# EAGLE design pcb_univ_3-101-0-x-rev2 (EAGLE 7.7.0)
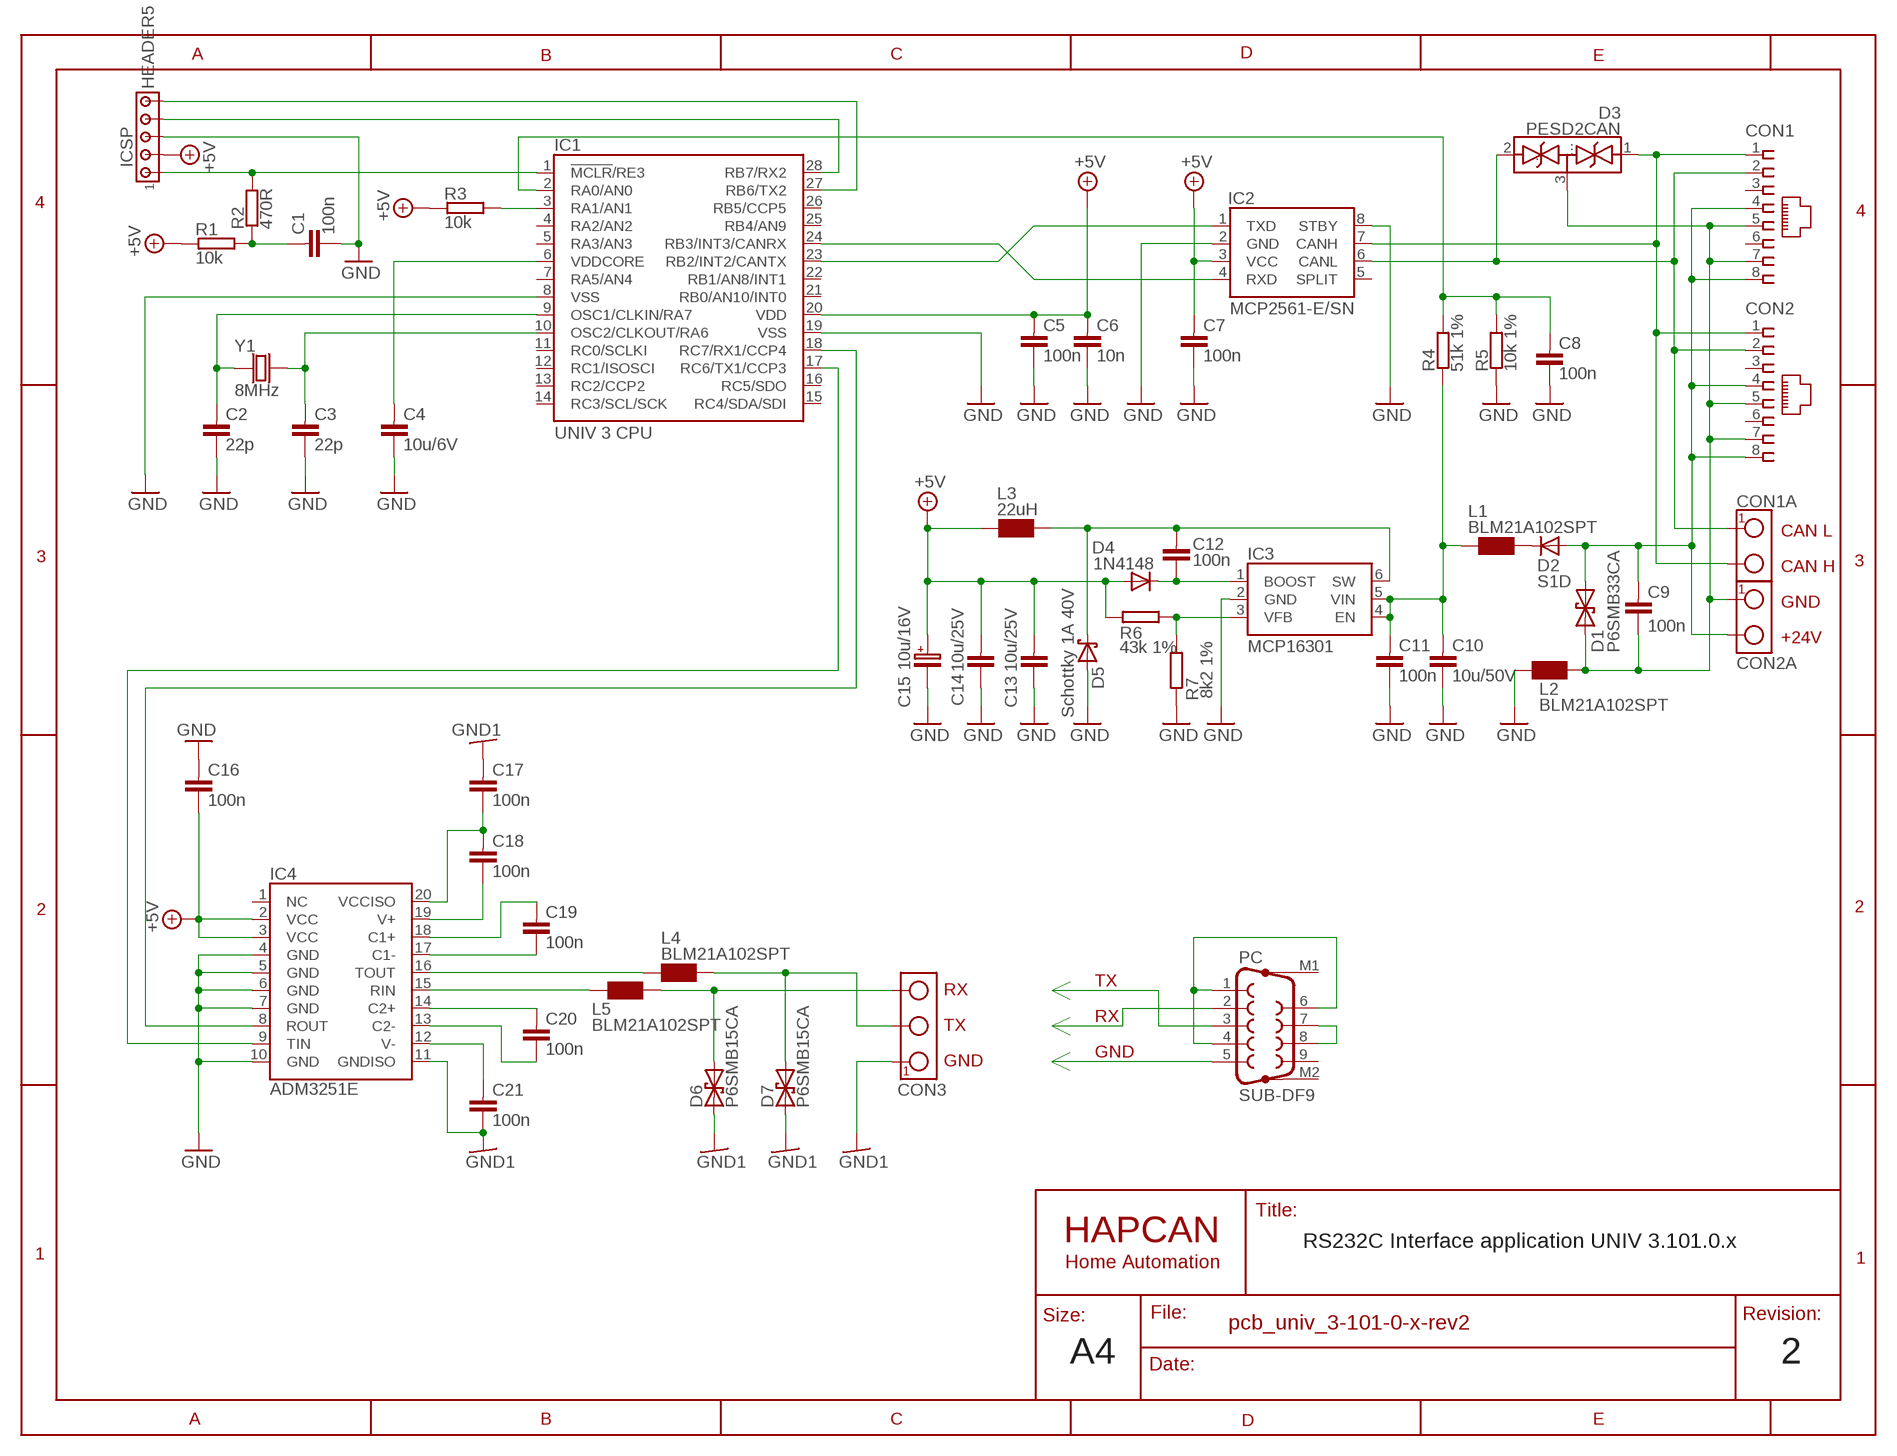
[diagram p0: schematic, sheet 1]

## Parts
C1  100n  CAPACITOR0805  [0805]
C2  22p  CAPACITOR0805  [0805]
C3  22p  CAPACITOR0805  [0805]
C4  10u/6V  CAPACITOR0805  [0805]
C5  100n  CAPACITOR0805  [0805]
C6  10n  CAPACITOR0805  [0805]
C7  100n  CAPACITOR0805  [0805]
C8  100n  CAPACITOR0805  [0805]
C9  100n  CAPACITOR0805  [0805]
C10  10u/50V  CAPACITOR1210  [1210]
C11  100n  CAPACITOR0805  [0805]
C12  100n  CAPACITOR0805  [0805]
C13  10u/25V  CAPACITOR1206  [1206]
C14  10u/25V  CAPACITOR1206  [1206]
C15  10u/16V  CAPACITOR-POLARIZED-SMC_B  [SMC_B]
C16  100n  CAPACITOR0805  [0805]
C17  100n  CAPACITOR0805  [0805]
C18  100n  CAPACITOR0805  [0805]
C19  100n  CAPACITOR0805  [0805]
C20  100n  CAPACITOR0805  [0805]
C21  100n  CAPACITOR0805  [0805]
CON1  RJ45-SOCKET  [RJ45-PCB-SOCKET]
CON1A  TERMINAL-2  TERMINAL-2-5X10,5MM  [ARK2-5X10,5MM]
CON2  RJ45-SOCKET  [RJ45-PCB-SOCKET]
CON2A  TERMINAL-2  TERMINAL-2-5X10,5MM  [ARK2-5X10,5MM]
CON3  TERMINAL-3-5X10.5MM  [ARK3-5X10.5MM]
D1  P6SMB33CA  DIODE_TRANSIL2  [DO-214_TRANSIL2]
D2  S1D  DIODE_DO-214  [DO-214]
D3  PESD2CAN  PESD2CANSOT-23  [SOT-23]
D4  1N4148  DIODE_0805  [0805]
D5  Schottky 1A 40V  DIODE_TRANSIL1_DO214  [DO-214]
D6  P6SMB15CA  DIODE_TRANSIL2  [DO-214_TRANSIL2]
D7  P6SMB15CA  DIODE_TRANSIL2  [DO-214_TRANSIL2]
IC1  UNIV 3 CPU  UNIV3CPU-I/SO  [UNIV3CPU]
IC2  MCP2561-E/SN  [SO-08]
IC3  MCP16301  MCP16301SOT23-6  [SOT-23-6]
IC4  ADM3251E  [SO-20W]
ICSP  HEADER5  [SIP-5]
L1  BLM21A102SPT  CHOKE0805  [0805]
L2  BLM21A102SPT  CHOKE0805  [0805]
L3  22uH  CHOKEDER0705  [CHOKE-DER0705]
L4  BLM21A102SPT  CHOKE0805  [0805]
L5  BLM21A102SPT  CHOKE0805  [0805]
PC  SUB-DF9  [SUB-D9FH-7.2MM]
R1  10k  RESISTOR0805  [0805]
R2  470R  RESISTOR0805  [0805]
R3  10k  RESISTOR0805  [0805]
R4  51k 1%  RESISTOR0805  [0805]
R5  10k 1%  RESISTOR0805  [0805]
R6  43k 1%  RESISTOR0805  [0805]
R7  8k2 1%  RESISTOR0805  [0805]
Y1  8MHz  CRYSTAL-HC49V  [CRYSTAL-HC49V]

## Nets
+5V: C5.1 C6.1 C7.1 C13.1 C14.1 C15.+ C16.2 D4.2(A) IC1.20(VDD) IC2.3(VCC) IC4.2(VCC) IC4.3(VCC) ICSP.2 L3.1 R1.1 R3.1 R6.1
GND: C1.2 C2.2 C3.2 C4.2 C5.2 C6.2 C7.2 C8.2 C10.2 C11.2 C13.2 C14.2 C15.- C16.1 D5.A IC1.8(VSS) IC1.19(VSS) IC2.2(GND) IC2.8(STBY) IC3.2(GND) IC4.4(GND) IC4.5(GND) IC4.6(GND) IC4.7(GND) IC4.10(GND) ICSP.3 L2.1 R5.1 R7.1
GNDIO: C17.1 C21.2 CON3.1 D6.C D7.C IC4.11(GNDISO) ; supply symbol labelled GND1
ICSP: IC1.1(!MCLR!/RE3) ICSP.1 R2.2
N$1: C20.2 IC4.13(C2-)
N$2: IC1.24(RB3/INT3/CANRX) IC2.4(RXD)
N$3: IC1.23(RB2/INT2/CANTX) IC2.1(TXD)
N$4: CON3.2 D7.A L4.1
N$5: C12.1 D5.C IC3.6(SW) L3.2
N$6: IC3.3(VFB) R6.2 R7.2
N$7: C1.1 R1.2 R2.1
N$8: C8.1 IC1.2(RA0/AN0) R4.2 R5.2
N$9: CON1.1 CON1A.2 CON2.1 D3.1(.) IC2.7(CANH)
N$10: IC1.28(RB7/RX2) ICSP.4
N$11: C2.1 IC1.9(OSC1/CLKIN/RA7) Y1.1
N$12: IC1.3(RA1/AN1) R3.2
N$13: CON1.2 CON1A.1 CON2.2 D3.2(..) IC2.6(CANL)
N$14: IC1.27(RB6/TX2) ICSP.5
N$15: C3.1 IC1.10(OSC2/CLKOUT/RA6) Y1.2
N$16: C10.1 C11.1 IC3.4(EN) IC3.5(VIN) L1.1 R4.1
N$17: PC.2
N$18: C9.2 CON1.5 CON1.7 CON2.5 CON2.7 CON2A.1 D1.C D3.3(...) L2.2
N$19: CON3.3 D6.A L5.1
N$20: PC.3
N$22: IC4.16(TOUT) L4.2
N$23: PC.7 PC.8
N$24: IC4.15(RIN) L5.2
N$25: C19.2 IC4.17(C1-)
N$26: C20.1 IC4.14(C2+)
N$27: C19.1 IC4.18(C1+)
N$28: PC.5
N$29: IC1.17(RC6/TX1/CCP3) IC4.9(TIN)
N$31: C18.2 IC4.19(V+)
N$33: IC1.18(RC7/RX1/CCP4) IC4.8(ROUT)
N$34: C17.2 C18.1 IC4.20(VCCISO)
N$35: C21.1 IC4.12(V-)
N$38: C12.2 D4.1(C) IC3.1(BOOST)
N$56: C4.1 IC1.6(VDDCORE)
N$59: C9.1 CON1.4 CON1.8 CON2.4 CON2.8 CON2A.2 D1.A D2.A
N$61: D2.C L1.2
PC: PC.1 PC.4 PC.6
Unconnected: CON1.3 CON1.6 CON2.3 CON2.6 IC1.4(RA2/AN2) IC1.5(RA3/AN3) IC1.7(RA5/AN4) IC1.11(RC0/SCLKI) IC1.12(RC1/ISOSCI) IC1.13(RC2/CCP2) IC1.14(RC3/SCL/SCK) IC1.15(RC4/SDA/SDI) IC1.16(RC5/SDO) IC1.21(RB0/AN10/INT0) IC1.22(RB1/AN8/INT1) IC1.25(RB4/AN9) IC1.26(RB5/CCP5) IC2.5(SPLIT) IC4.1(NC) PC.9 PC.M1(G1) PC.M2(G2)

## Notes on the sheet
- CAN L
- CAN H
- GND
- +24V
- TX
- RX
- RX
- TX
- GND
- GND
- RS232C Interface application UNIV 3.101.0.x
- A4 | 2

## Library data of the parts
C1-C14 C16-C21 = HAPCAN_devices - UNIV3:CAPACITOR: HAPCAN Capacitor
C15 = HAPCAN_devices - UNIV3:CAPACITOR-POLARIZED: HAPCAN Polarazied Capacitor
CON1 CON2 = HAPCAN_devices - UNIV3:RJ45-SOCKET: HAPCAN RJ45 socket
CON1A CON2A = HAPCAN_devices - UNIV3:TERMINAL-2: HAPCAN Terminal Block - 2 way
CON3 = HAPCAN_devices - UNIV3:TERMINAL-3: HAPCAN Terminal Block - 3 way
D1 D6 D7 = HAPCAN_devices - UNIV3:DIODE_TRANSIL2: HAPCAN Bidirectional transil diode
D2 D4 = HAPCAN_devices - UNIV3:DIODE: HAPCAN Rectifier Diode
D3 = HAPCAN_devices - UNIV3:PESD2CAN: CAN bus ESD protection diode
D5 = HAPCAN_devices - UNIV3:DIODE_TRANSIL1: HAPCAN Unidirectional transil diode
IC1 = HAPCAN_devices - UNIV3:UNIV3CPU: HAPCAN Microcontroller UNIV 3 CPU
IC2 = HAPCAN_devices - UNIV3:MCP2561: HAPCAN CAN Tranceiver
IC3 = HAPCAN_devices - UNIV3:MCP16301: High Voltage Input Integrated Switch Step-Down Regulator
IC4 = HAPCAN_devices - UNIV3:ADM3251E: RS232C isolated transceiver
ICSP = HAPCAN_devices - UNIV3:HEADER5: HAPCAN Header 5
L1-L5 = HAPCAN_devices - UNIV3:CHOKE: Choke
PC = HAPCAN_devices - UNIV3:SUB-DF9: HAPCAN SUB-D 9 pin female connector
R1-R7 = HAPCAN_devices - UNIV3:RESISTOR: HAPCAN Resistor
Y1 = HAPCAN_devices - UNIV3:CRYSTAL: HAPCAN Crystal

## Board
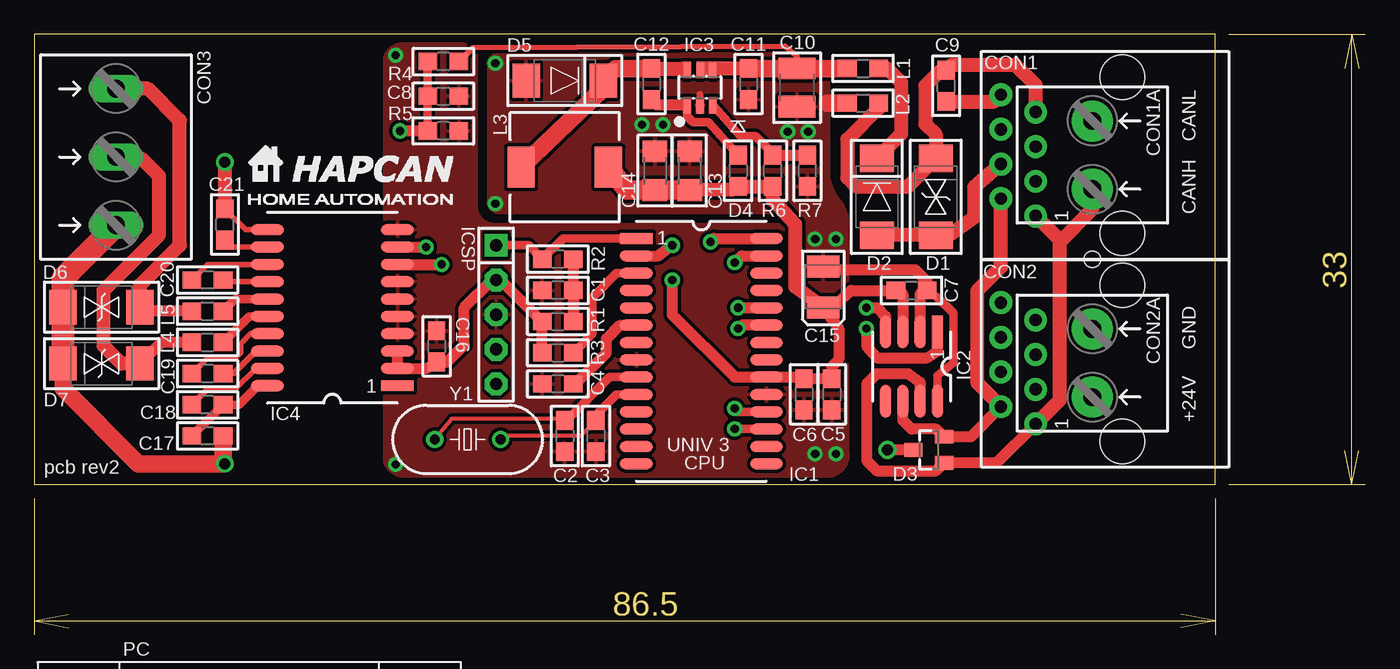
[diagram p1: board, top side]
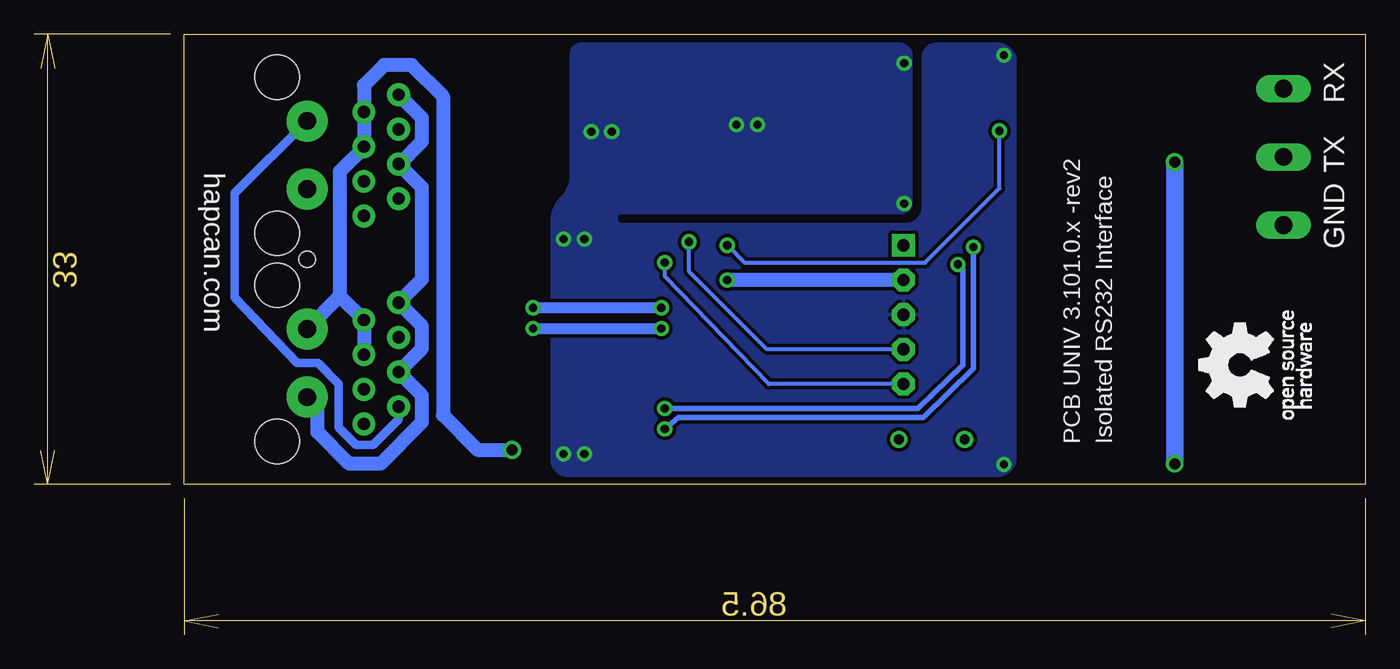
[diagram p2: board, bottom side, seen from below]

Size 97.5 x 44 mm. Coordinates in mm from the lower left corner, seen from the top.
Outline: 0,10 0,1
Outline: 0,1 0,0
Outline: 86.5,10 86.5,1
Outline: 86.5,1 86.5,0
Outline: 0,1 86.5,1
Outline: 86.5,1 84,1.5
Outline: 86.5,1 84,0.5
Outline: 0,1 2.5,1.5
Outline: 0,1 2.5,0.5
Outline: 87.5,11 96.5,11
Outline: 96.5,11 97.5,11
Outline: 87.5,44 96.5,44
Outline: 96.5,44 97.5,44
Outline: 96.5,11 96.5,44
Outline: 96.5,44 96,41.5
Outline: 96.5,44 97,41.5
Outline: 96.5,11 96,13.5
Outline: 96.5,11 97,13.5
Outline: 86.5,11 86.5,44 0,44 0,11 86.5,11
Copper layers (1*16): Top 0.035mm / dielectric 1.5mm / Bottom 0.035mm
Design rules "HAPCAN-Drc *": minimum track width 10mil, minimum drill 0.5mm, track to track 10mil, track to pad 10mil, pad to pad 12mil, via to via 12mil, smd to smd 0mil, copper to edge 20mil, drill to drill 8mil, minimum pad ring 10mil, minimum via ring 10mil, stop-mask expansion 4mil, vias tented up to drill 0mil, thermal gap 10mil
Holes 1.2 mm at 77.5,27.5

### Footprints (pad centres in the part's own frame; a part is rotated, then mirrored left to right if it is on the bottom)
0805 = smd 1.372 x 1.27: 1 -1.143,0; 2 1.143,0
1210 = smd 1.6 x 2.7: 1 -1.4,0; 2 1.4,0
1206 = smd 1.6 x 1.803: 1 -1.422,0; 2 1.422,0
SMC_B = smd 1.6 x 2.4: + -1.5,0; - 1.5,0
RJ45-PCB-SOCKET = drill 0.9 pad 1.676: 1 -4.445,6.35; 2 -3.175,8.89; 3 -1.905,6.35; 4 -0.635,8.89; 5 0.635,6.35; 6 1.905,8.89; 7 3.175,6.35; 8 4.445,8.89 | hole 3.251: -5.715,0; 5.715,0
ARK2-5X10,5MM = drill 1.3 pad 3: 1 -2.5,0; 2 2.5,0
ARK3-5X10.5MM = drill 1.3 pad 2 long: 1 -5,0; 2 0,0; 3 5,0
DO-214_TRANSIL2 = smd 2 x 2.5: A 2.82,0; C -2.82,0
DO-214 = smd 2 x 2.5: A 2.82,0; C -2.82,0
SOT-23 = smd 1.016 x 1.321: 1 -0.965,-1.118; 2 0.965,-1.118; 3 0,1.118
UNIV3CPU = smd 2.4 x 0.8: 1 -4.763,8.255; 2 -4.763,6.985; 3 -4.763,5.715; 4 -4.763,4.445; 5 -4.763,3.175; 6 -4.763,1.905; 7 -4.763,0.635; 8 -4.763,-0.635; 9 -4.763,-1.905; 10 -4.763,-3.175; 11 -4.763,-4.445; 12 -4.763,-5.715; 13 -4.763,-6.985; 14 -4.763,-8.255; 15 4.763,-8.255; 16 4.763,-6.985; 17 4.763,-5.715; 18 4.763,-4.445; 19 4.763,-3.175; 20 4.763,-1.905; 21 4.763,-0.635; 22 4.763,0.635; 23 4.763,1.905; 24 4.763,3.175; 25 4.763,4.445; 26 4.763,5.715; 27 4.763,6.985; 28 4.763,8.255
SO-08 = smd 2.4 x 0.8: 1 -2.54,1.905; 2 -2.54,0.635; 3 -2.54,-0.635; 4 -2.54,-1.905; 5 2.54,-1.905; 6 2.54,-0.635; 7 2.54,0.635; 8 2.54,1.905
SOT-23-6 = smd 0.55 x 1.2: 1 -0.95,-1.3; 2 0,-1.3; 3 0.95,-1.3; 4 0.95,1.3; 5 0.003,1.3; 6 -0.95,1.3
SO-20W = smd 2.4 x 0.8: 1 -4.763,5.715; 2 -4.763,4.445; 3 -4.763,3.175; 4 -4.763,1.905; 5 -4.763,0.635; 6 -4.763,-0.635; 7 -4.763,-1.905; 8 -4.763,-3.175; 9 -4.763,-4.445; 10 -4.763,-5.715; 11 4.763,-5.715; 12 4.763,-4.445; 13 4.763,-3.175; 14 4.763,-1.905; 15 4.763,-0.635; 16 4.763,0.635; 17 4.763,1.905; 18 4.763,3.175; 19 4.763,4.445; 20 4.763,5.715
SIP-5 = drill 0.9 pad 1.676 square: 1 -5.08,0 | drill 0.9 pad 1.676 octagon: 2 -2.54,0; 3 0,0; 4 2.54,0; 5 5.08,0
CHOKE-DER0705 = smd 2 x 3: 1 -3.2,0; 2 3.2,0
SUB-D9FH-7.2MM = drill 1.194 pad 1.676 square: 1 5.537,2.033 | drill 1.194 pad 1.676 octagon: 2 2.769,2.033; 3 0,2.033; 4 -2.769,2.033; 5 -5.537,2.033; 6 4.153,-0.81; 7 1.384,-0.81; 8 -1.384,-0.81; 9 -4.153,-0.81 | drill 3.048: M1 -12.446,0.635; M2 12.446,0.635
CRYSTAL-HC49V = drill 0.7 pad 1.27: 1 -2.413,0; 2 2.413,0

### Placement (x,y rotation side)
C1  38.35,25.22 180 top
C2  38.86,14.56 270 top
C3  41.15,14.56 270 top
C4  38.35,18.37 180 top
C5  56.39,17.6 270 top
C6  58.42,17.6 270 top
C7  64.26,25.22 0 top
C8  29.97,39.45 0 top
C9  66.8,40.21 90 top
C10  55.88,40.08 270 top
C11  52.32,40.34 270 top
C12  45.21,40.34 270 top
C13  48.01,33.99 90 top
C14  45.47,33.99 90 top
C15  57.78,25.48 90 top
C16  29.48,21.12 270 top
C17  12.7,14.56 180 top
C18  12.7,16.84 180 top
C19  12.7,19.13 180 top
C20  12.7,25.99 180 top
C21  13.97,30.05 90 top
CON1  79.7,35.12 90 top
CON1A  77.5,35.14 270 top
CON2  79.7,19.88 90 top
CON2A  77.5,19.9 270 top
CON3  6,35 90 top
D1  66.04,32.08 270 top
D2  61.72,32.08 270 top
D3  65.53,13.54 90 top
D4  51.56,33.99 270 top
D5  38.86,40.59 180 top
D6  4.94,23.99 0 top
D7  4.94,19.86 0 top
IC1  48.87,20.77 0 top
IC2  64.26,19.64 270 top
IC3  48.77,40.08 0 top
IC4  21.84,23.95 180 top
ICSP  33.83,23.45 270 top
L1  60.71,41.48 0 top
L2  60.71,38.94 0 top
L3  38.86,34.24 180 top
L4  12.7,21.41 0 top
L5  12.7,23.7 0 top
PC  15.75,-6.02 0 top  (outside the outline)
R1  38.35,22.94 0 top
R2  38.35,27.51 180 top
R3  38.35,20.65 0 top
R4  29.97,41.99 180 top
R5  29.97,36.91 180 top
R6  54.1,33.99 90 top
R7  56.64,33.99 90 top
Y1  31.75,14.3 0 top

### Tracks (layer width: path | path; a pad name or v marks a point on that pad's centre or on a via)
+5V  (via drill 0.6 pad 1.02)
  Top 0.406: IC2.3 63.63,22.43
  Top 0.813: v46.74,25.99 46.73,25.72 46.73,23.45 51.32,18.87 IC1.20 56.02,18.87 C5.1 C6.1 58.42,19.64 58.93,20.14 58.93,22.43 C15.+ 58.42,23.95 59.84,25.22 C7.1 63.63,24.97 63.62,24.97 IC2.3 | IC4.3 IC4.2 28.75,19.51 C16.2 30.24,19.98 31.5,21.23 31.5,23.95 33.53,25.99 ICSP.2 34.16,25.99 R1.1 | R3.1 R1.1 | R1.1 37.34,22.94
  Top 1.016: C13.1 51.08,32.59 D4.2 R6.1 54.1,31.83 55.75,30.05 55.75,25.48 57.76,23.98 C15.+
  Top 1.422: C13.1 C14.1 43.43,32.56 L3.1
  Bottom 1.016: ICSP.2 v46.74,25.99
GND  (via drill 0.6 pad 1.02)
  Top 0.406: IC2.2 64.9,22.43 | IC2.8 66.16,17.35
  Top 0.508: 48.77,39.58 IC3.2
  Top 0.61: IC2.8 66.16,19 67.31,19.89 67.31,23.57 66.17,24.72 C7.2
  Top 0.813: IC2.2 64.89,24.96 C7.2 65.41,25.86 64.52,26.75 58.14,26.75 C15.-
  Top 1.016: D5.A 35.53,41.1
  Top 1.27: L2.1 58.12,38.94
  other vias: 55.19,36.86 33.78,41.86 46.05,37.37 44.53,37.37 56.69,36.86 33.78,31.57 58.72,28.98 57.2,28.98 58.72,13.24 57.2,13.24 26.47,42.45 26.47,12.47
  pour Top: 34.29,42.62 58.17,42.62 58.17,31.7 57.91,30.94 34.04,30.94 arc-90 33.27,31.7 33.27,41.86 arc-90
  pour Top: 26.92,43.26 arc90 25.65,41.99 25.65,12.9 arc90 27.18,11.63 58.42,11.63 arc90 59.56,13.54 59.56,28.02 arc90 58.42,30.05 33.78,30.05 arc-90 32.38,31.32 32.38,41.99 arc90 31.5,43.26
  pour Top: 55.88,31.07 56.64,30.3 56.64,29.29 56.9,29.03 59.56,29.03 59.56,30.3 arc30 59.05,31.7 arc-30 58.17,33.61
  pour Bottom: 33.27,42.5 33.27,31.7 arc97 34.16,30.94 54.48,30.94 arc-90 54.86,30.56 54.86,30.43 arc-90 54.48,30.05 33.78,30.05 arc-90 32.38,31.32 32.38,42.37 arc90 31.37,43.26 26.92,43.26 arc90 25.65,41.99 25.65,13.03 arc95 27.18,11.63 58.29,11.63 arc90 59.56,12.78 59.56,29.92 arc46 58.93,31.95 arc-48 58.17,33.61 58.17,42.5 arc90 57.4,43.26 34.16,43.26 arc90
GNDIO  (via drill 0.8)
  Top 0.406: IC4.11 15.49,29.67 C21.2
  Top 1.016: v13.97,34.62 C21.2
  Top 1.27: D7.C 2.12,18.02 7.62,12.52 v13.97,12.52 13.84,12.65 C17.1
  Top 1.676: D7.C D6.C 2.12,26.12 CON3.1
  Bottom 1.27: v13.97,12.52 v13.97,34.62
ICSP
  Top 0.61: IC1.1 38.73,29.02 R2.2 36.2,28.53 ICSP.1
N$1
  Top 0.406: C20.2 12.7,27.13 IC4.13
N$2  (via drill 0.6 pad 1.02)
  Top 0.406: IC2.4 62.35,22.43
  Top 0.813: v60.96,23.95 61.72,23.95 62.36,23.32 62.35,23.32 IC2.4 | IC1.24 51.83,23.95 v51.56,23.95
  Bottom 0.813: v60.96,23.95 v51.56,23.95
N$3  (via drill 0.6 pad 1.02)
  Top 0.813: v60.96,22.43 60.96,21.16 61.72,20.27 65.41,20.27 66.17,20.78 66.17,22.43 IC2.1 | IC1.23 51.81,22.68 v51.56,22.43
  Bottom 0.813: v60.96,22.43 v51.56,22.43
N$4
  Top 0.813: L4.1 9.31,21.41 D7.A
  Top 1.016: D7.A 6.38,19.86 5.08,21.16 5.08,25.22 9.14,29.29 9.14,33.61 7.87,34.88 6.12,34.88 CON3.2
N$5
  Top 0.254: 47.57,41.48 47.72,41.48 IC3.6
  Top 1.016: D5.C 42.57,41.48 | C12.1 47.57,41.48
  Top 1.27: 42.57,41.48 C12.1 | L3.2 41.68,40.01 D5.C
N$6
  Top 0.61: R6.2 53.98,35.38 52.83,36.53 51.72,36.53 IC3.3
  Top 0.813: R6.2 R7.2
N$7
  Top 0.813: R2.1 R1.2 C1.1
N$8  (via drill 0.6)
  Top 0.61: R4.2 C8.1 R5.2
  Top 0.813: IC1.2 45.71,27.75 v46.74,28.53 | R5.2 v26.8,36.91
  Bottom 0.305: v46.74,28.53 45.47,27.26 32.26,27.26 26.8,32.72 v26.8,36.91
N$9
  Top 0.406: IC2.7 64.89,17.35
  Top 0.813: CON2.1 70.49,12.57 D3.1 66.06,12.02 61.72,12.02 60.96,12.78 60.96,18.37 61.72,19.13 64.01,19.13 64.9,18.49 64.89,18.24 IC2.7
  Top 1.016: CON2.1 75.11,17.19 75.11,28.78 | 75.11,28.78 75.11,28.92 CON1.1 | CON1A.2 77.5,31.17 75.11,28.78
N$10  (via drill 0.6 pad 1.02)
  Top 0.813: IC1.28 49.77,29.02 v49.53,28.78
  Bottom 0.305: ICSP.4 43.81,20.91 49.53,26.62 v49.53,28.78
N$11
  Top 0.305: Y1.1 30.61,15.83 38.73,15.83
  Top 0.61: IC1.9 42.16,18.87 38.99,15.7 C2.1 38.73,15.83
N$12
  Top 0.61: IC1.3 42.66,26.48 40.89,24.72 40.89,22.05 R3.2
N$13
  Top 0.406: IC2.6 63.62,17.35
  Top 0.813: CON2.2 68.61,14.5 D3.2 66.06,15.06 64.26,15.06 63.62,15.7 IC2.6 63.63,17.35
  Top 1.016: CON2.2 69.09,18.43 69.09,25.22 70.81,26.95 CON1.2
  Bottom 0.61: CON2.2 70.81,15.75 72.67,13.9 73.91,13.9 75.18,15.17 75.18,18.37 76.71,19.89 78.23,19.89 82.8,24.72 82.8,32.34 CON1A.1
N$14  (via drill 0.6 pad 1.02)
  Top 0.813: IC1.27 51.83,27.75 v51.31,27.26
  Bottom 0.305: ICSP.5 43.69,18.37 51.31,26.24 v51.31,27.26
N$15
  Top 0.305: C3.1 40.01,14.56 34.42,14.56 arc90 Y1.2
  Top 0.61: IC1.10 42.66,17.59 41.15,16.08 C3.1
N$16
  Top 0.254: IC3.5 IC3.4
  Top 0.406: C10.1 55.88,42.37 54.99,43.13 32.13,43 R4.1
  Top 1.016: C11.1 49.05,41.48 IC3.4 | C10.1
  Top 1.27: C11.1 C10.1 | L1.1 C10.1
N$18  (via drill 0.8)
  Top 0.813: D3.3 v62.48,13.54
  Top 1.016: CON1.7 73.35,40.27 71.88,41.73 67.18,41.73 C9.2 66.42,41.35 65.28,40.21 65.28,37.42 66.04,36.65 66.04,35.13 | 66.04,35.13 D1.C 65.65,34.51 | 65.65,34.51 63.98,32.84 60.2,32.84 59.56,33.48 59.56,36.27 61.85,38.56 L2.2 | 66.04,35.13 65.65,34.51
  Bottom 1.016: CON2.5 CON2.7 75.11,24.81 | 75.11,24.81 75.11,33.94 73.35,35.69 CON1.5 CON1.7 73.35,40.27 71.88,41.73 69.85,41.73 67.56,39.45 67.56,16.08 65.02,13.54 v62.48,13.54 | CON2A.1 75.11,24.79 75.11,24.81
N$19
  Top 0.813: L5.1 8.05,23.7 D6.A
  Top 1.016: D6.A 7.76,25.62 10.67,28.53 10.67,37.67 8.34,40 CON3.3
N$22
  Top 0.61: IC4.16 15.75,23.32 L4.2
N$23  (1 unrouted)
N$24
  Top 0.61: IC4.15 14.73,24.59 L5.2
N$25
  Top 0.406: C19.2 12.7,20.27 14.73,20.27 15.11,20.65 15.11,21.29 15.88,22.05 IC4.17
N$26
  Top 0.406: IC4.14 13.97,25.86 C20.1
N$27
  Top 0.406: C19.1 14.61,19.13 16.26,20.78 IC4.18
N$29  (via drill 0.6)
  Top 0.61: IC1.17 v51.31,15.05 v51.31,15.06
  Top 0.813: IC4.9 v28.7,28.4
  Bottom 0.406: v51.31,15.06 50.29,15.9 32.38,15.9 28.7,19.51 v28.7,28.4
N$31
  Top 0.406: C18.2 12.7,17.98 14.73,17.98 16.26,19.51 IC4.19
  Top 0.61: 16.38,19.51 IC4.19
N$33  (via drill 0.6)
  Top 0.61: IC1.18 51.57,16.32 v51.31,16.56
  Top 0.813: IC4.8 v29.84,27.13
  Bottom 0.406: v29.84,27.13 29.46,26.75 29.46,19.76 32.77,16.56 v51.31,16.56
N$34
  Top 0.61: C17.2 C18.1 14.99,16.84 16.38,18.24 IC4.20
N$35
  Top 0.406: IC4.12 14.48,28.4 C21.1
N$38
  Top 0.254: IC3.1 47.53,38.78 47.5,38.81
  Top 0.61: IC3.1 47.82,37.98 48.26,37.54 49.4,37.54 D4.1
  Top 0.813: 47.5,38.81 45.59,38.81 C12.2
N$56
  Top 0.813: C4.1 39.62,18.37 41.91,20.65 41.91,21.67 42.92,22.68 IC1.6
N$59
  Top 1.016: D2.A D1.A 67.03,29.26 68.83,30.56 68.83,32.76 CON1.4 | C9.1 70.31,39.07 CON1.8
  Bottom 1.016: CON1.8 69.09,37.84 69.09,36.15 70.75,34.48 CON1.4 69.09,32.76 69.09,26.05 CON2.8 69.09,22.6 69.09,20.97 CON2.4 69.09,17.52 69.09,15.57 72.14,12.52 74.42,12.52 76.74,14.84 76.74,16.64 CON2A.2
N$61
  Top 1.016: 62.23,35.41 D2.C 63.5,36.68 63.5,40.46 62.48,41.48 L1.2
PC  (2 unrouted)

### Text on the board
Dimension: 33 | 86.5
tPlace: CANL | CANH | GND | +24V | pcb rev2
bPlace: RX | TX | hapcan.com | GND | Isolated RS232 Interface | PCB UNIV 3.101.0.x -rev2